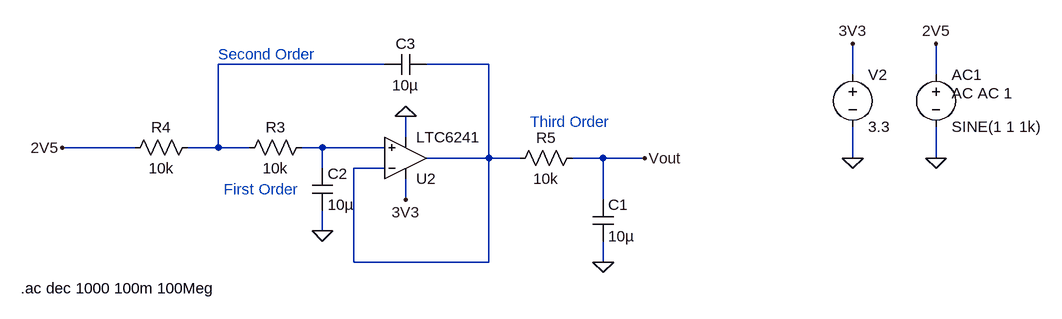
[diagram p0: schematic 3orde_butterworth_hp.asc]
3orde_butterworth_hp.asc, the LTspice schematic file:
Version 4
SHEET 1 880 680
WIRE -480 64 -736 64
WIRE -320 64 -416 64
WIRE 240 80 240 32
WIRE 368 80 368 32
WIRE -448 176 -448 144
WIRE -864 192 -976 192
WIRE -736 192 -736 64
WIRE -736 192 -784 192
WIRE -688 192 -736 192
WIRE -576 192 -608 192
WIRE -480 192 -576 192
WIRE -320 208 -320 64
WIRE -320 208 -416 208
WIRE -272 208 -320 208
WIRE -144 208 -192 208
WIRE -80 208 -144 208
WIRE 240 208 240 160
WIRE 368 208 368 160
WIRE -576 224 -576 192
WIRE -480 224 -528 224
WIRE -448 272 -448 240
WIRE -144 272 -144 208
WIRE -576 320 -576 288
WIRE -528 368 -528 224
WIRE -320 368 -320 208
WIRE -320 368 -528 368
WIRE -144 368 -144 336
FLAG -448 144 0
FLAG 240 32 3V3
FLAG 368 32 2V5
FLAG 368 208 0
FLAG 240 208 0
FLAG -448 272 3V3
FLAG -576 320 0
FLAG -976 192 2V5
FLAG -144 368 0
FLAG -80 208 Vout
SYMBOL voltage 368 64 R0
WINDOW 123 24 44 Left 2
WINDOW 39 0 0 Left 0
SYMATTR Value2 AC AC 1
SYMATTR InstName AC1
SYMATTR Value SINE(1 1 1k)
SYMBOL voltage 240 64 R0
WINDOW 123 0 0 Left 0
WINDOW 39 0 0 Left 0
SYMATTR InstName V2
SYMATTR Value 3.3
SYMBOL OpAmps\\LTC6241 -448 208 M180
SYMATTR InstName U2
SYMBOL res -704 208 R270
WINDOW 0 32 56 VTop 2
WINDOW 3 0 56 VBottom 2
SYMATTR InstName R3
SYMATTR Value 10k
SYMBOL res -880 208 R270
WINDOW 0 32 56 VTop 2
WINDOW 3 0 56 VBottom 2
SYMATTR InstName R4
SYMATTR Value 10k
SYMBOL cap -592 224 R0
SYMATTR InstName C2
SYMATTR Value 10µ
SYMBOL cap -416 48 R90
WINDOW 0 0 32 VBottom 2
WINDOW 3 32 32 VTop 2
SYMATTR InstName C3
SYMATTR Value 10µ
SYMBOL res -176 192 R90
WINDOW 0 0 56 VBottom 2
WINDOW 3 32 56 VTop 2
SYMATTR InstName R5
SYMATTR Value 10k
SYMBOL cap -160 272 R0
SYMATTR InstName C1
SYMATTR Value 10µ
TEXT -1040 408 Left 2 !.ac dec 1000 100m 100Meg
TEXT -736 48 Left 2 ;Second Order
TEXT -728 256 Left 2 ;First Order
TEXT -256 152 Left 2 ;Third Order

The netlist it stands for:
* 3orde_butterworth_hp.asc
V§AC1 2V5 0 SINE(1 1 1k) AC AC 1
V2 3V3 0 3.3
XU2 N003 N002 3V3 0 N002 LTC6241  ; pins In+ In- V+ V- OUT
R3 N001 N003 10k
R4 2V5 N001 10k
C2 N003 0 10µ
C3 N002 N001 10µ
R5 Vout N002 10k
C1 Vout 0 10µ
.ac dec 1000 100m 100Meg
* Second Order
* First Order
* Third Order
.lib LTC4.lib
.backanno
.end